# EAGLE design Stepper Motor Driver TIP Version v1.0 (EAGLE 6.5.0)
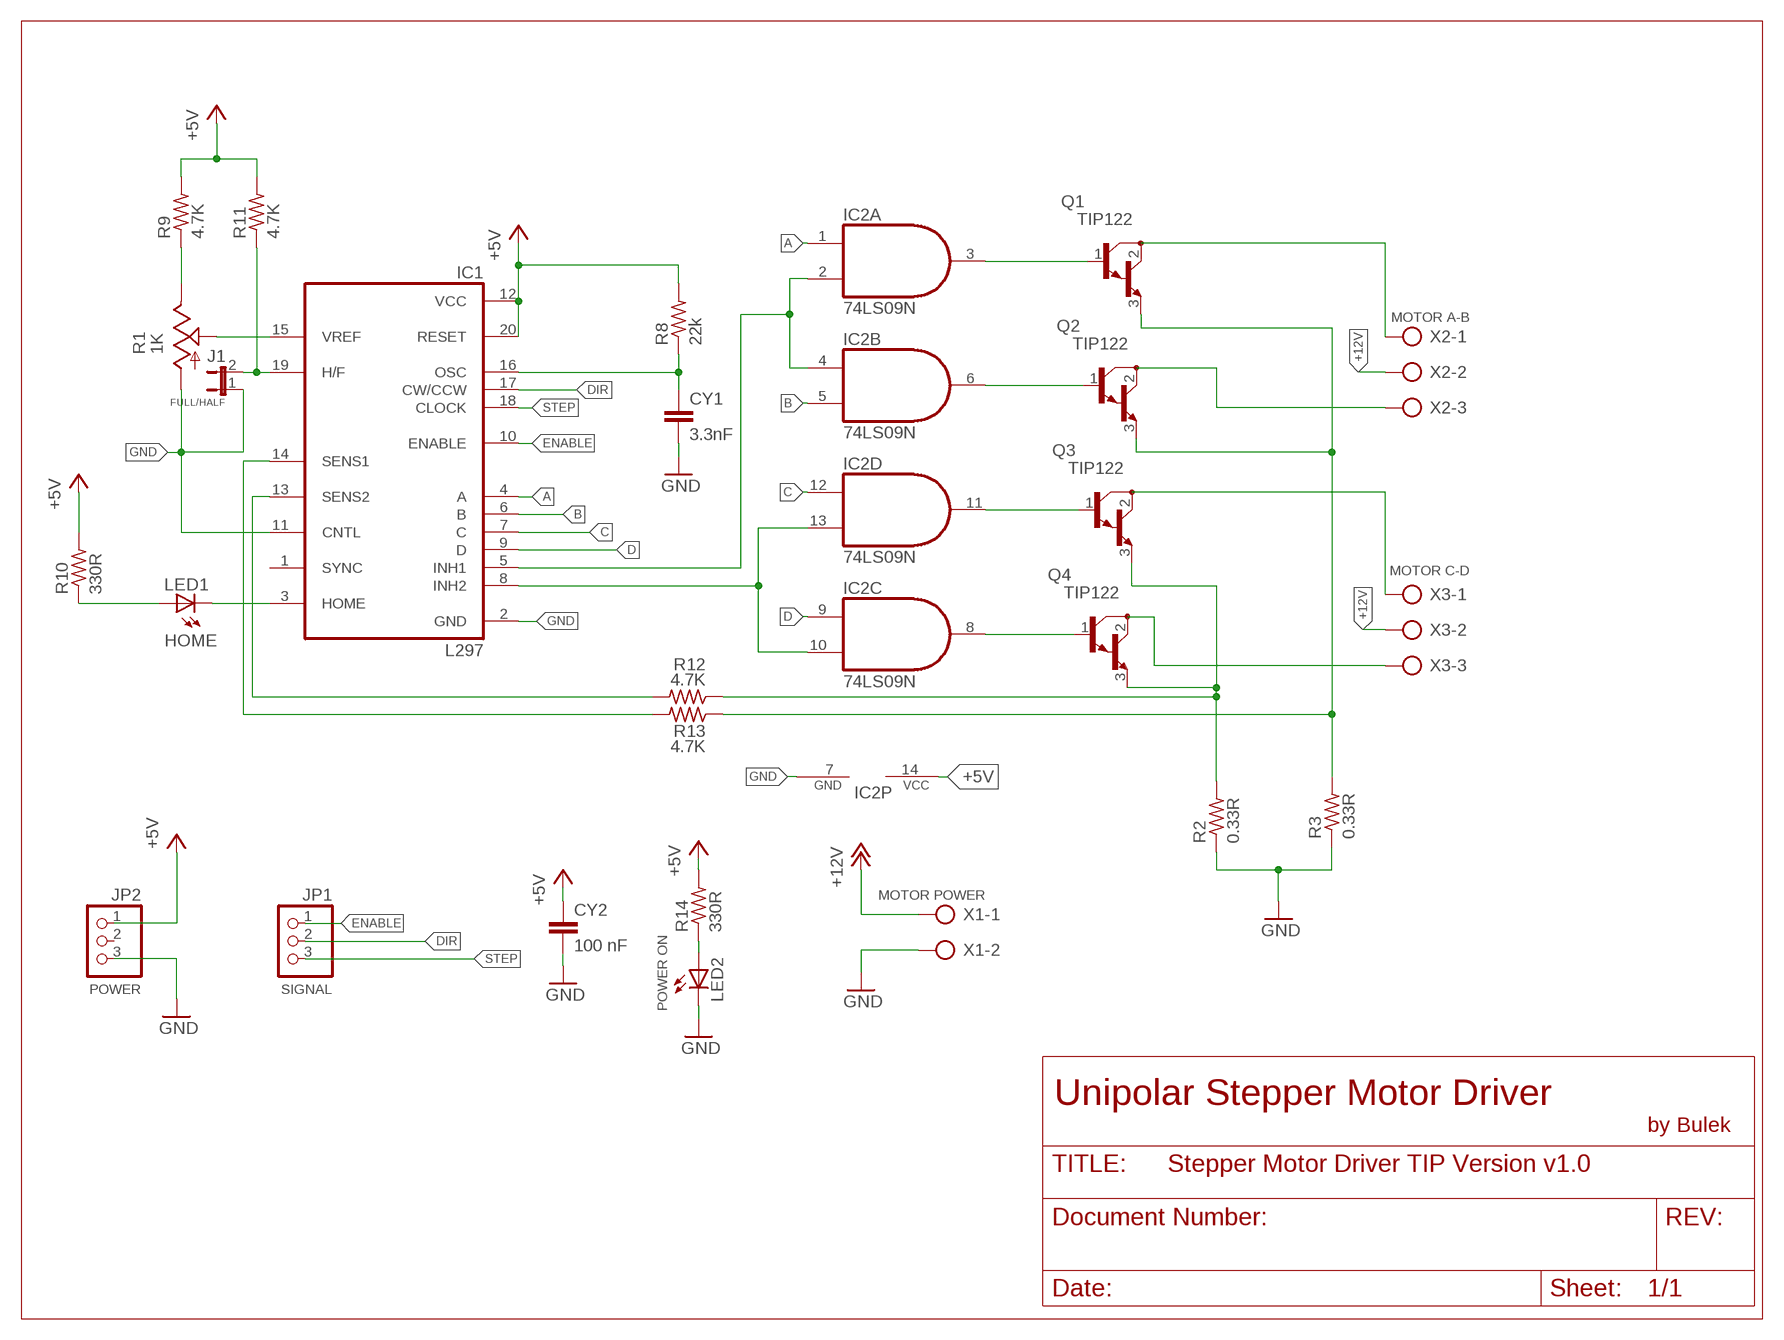
[diagram p0: schematic, sheet 1]

## Parts
CY1  3.3nF  CYYC7B5  [YC7B5]
CY2  100 nF  CYYC7B5  [YC7B5]
FULL/HALF  J1  JP1E  [JP1]
IC1  L297  [DIL20]
IC2  74LS09N  [DIL14]
JP1  SIGNAL  PINHD-1X3/90  [1X03/90]
JP2  POWER  PINHD-1X3/90  [1X03/90]
LED1  HOME  LED5MM  [LED5MM]
LED2  POWER ON  LED5MM  [LED5MM]
Q1  TIP122  [TO220V]
Q2  TIP122  [TO220V]
Q3  TIP122  [TO220V]
Q4  TIP122  [TO220V]
R1  1K  TRIM_US-S63X  [S63X]
R2  0.33R  R-US_0617/22  [0617/22]
R3  0.33R  R-US_0617/22  [0617/22]
R8  22k  R-US_0207/10  [0207/10]
R9  4.7K  R-US_0207/10  [0207/10]
R10  330R  R-US_0207/10  [0207/10]
R11  4.7K  R-US_0207/10  [0207/10]
R12  4.7K  R-US_0207/10  [0207/10]
R13  4.7K  R-US_0207/10  [0207/10]
R14  330R  R-US_0207/10  [0207/10]
X1  MOTOR POWER  AK300/2  [AK300/2]
X2  MOTOR A-B  AK300/3  [AK300/3]
X3  MOTOR C-D  AK300/3  [AK300/3]

## Nets
+5V: CY2.1 IC1.12(VCC) IC1.20(RESET) IC2.14(P:VCC) JP2.1 R8.2 R9.2 R10.2 R11.2 R14.2
+12V: X1.1 X2.2 X3.2
A: IC1.4(A) IC2.1(A:I0)
B: IC1.6(B) IC2.5(B:I1)
C: IC1.7(C) IC2.12(D:I0)
D: IC1.9(D) IC2.9(C:I0)
DIR: IC1.17(CW/CCW) JP1.2
ENABLE: IC1.10(ENABLE) JP1.1
GND: CY1.2 CY2.2 FULL/HALF.1 IC1.2(GND) IC1.11(CNTL) IC2.7(P:GND) JP2.3 LED2.K(C) R1.A R2.1 R3.1 X1.2
INH1: IC1.5(INH1) IC2.2(A:I1) IC2.4(B:I0)
INH2: IC1.8(INH2) IC2.10(C:I1) IC2.13(D:I1)
N$1: R1.E R9.1
N$2: IC1.15(VREF) R1.S
N$3: CY1.1 IC1.16(OSC) R8.1
N$4: IC1.3(HOME) LED1.K(C)
N$5: LED1.A R10.1
N$6: FULL/HALF.2 IC1.19(H/F) R11.1
N$7: IC1.14(SENS1) R13.2
N$8: IC1.13(SENS2) R12.2
N$9: IC2.8(C:O) Q4.1(B)
N$10: IC2.11(D:O) Q3.1(B)
N$11: IC2.6(B:O) Q2.1(B)
N$12: IC2.3(A:O) Q1.1(B)
N$13: Q1.3(E) Q2.3(E) R3.2 R13.1
N$14: Q3.3(E) Q4.3(E) R2.2 R12.1
N$15: Q1.2(C) X2.1
N$16: Q2.2(C) X2.3
N$17: Q3.2(C) X3.1
N$18: Q4.2(C) X3.3
N$20: LED2.A R14.1
STEP: IC1.18(CLOCK) JP1.3
Unconnected: IC1.1(SYNC) JP2.2

## Notes on the sheet
- Unipolar Stepper Motor Driver
- by Bulek

## Library data of the parts
CY1 CY2 = resistor:CY: Y CAPACITOR for power line
FULL/HALF = jumper:JP1E: JUMPER
IC1 = st-microelectronics:L297: STEPPER MOTOR CONTROLLER; MPN: L297/1; OC_FARNELL: 1094209; OC_NEWARK: 56P8258
IC2 = 74xx-us:74*09: Quad 2-input AND gate, open collector
JP1 JP2 = pinhead:PINHD-1X3: PIN HEADER
LED1 LED2 = led:LED: LED OSRAM: - CHIPLED LG R971, LG N971, LY N971, LG Q971, LY Q971, LO R971, LY R971 LH N974, LH R974 LS Q976, LO Q976, LY Q976 LO Q996 - Hyper CHIPLED LW Q18S LB Q993, LB Q99A, LB R99A - SideLED LS A670, LO A670, LY A670, LG A670, LP A670 LB A673, LV A673, LT A673, LW A673 LH A674 LY A675 LS A676, LA A676, LO A676, LY A676, LW A676 LS A679, LY A679, LG A679 - Hyper Micro SIDELED® LS Y876, LA Y876, LO Y876, LY Y876 LT Y87S - SmartLED LW L88C, LW L88S LB L89C, LB L89S, LG L890 LS L89K, LO L89K, LY L89K LS L896, LA L896, LO L896, LY L896 - TOPLED LS T670, LO T670, LY T670, LG T670, LP T670 LSG T670, LSP T670, LSY T670, LOP T670, LYG T670 LG T671, LOG T671, LSG T671 LB T673, LV T673, LT T673, LW T673 LH T674 LS T676, LA T676, LO T676, LY T676, LB T676, LH T676, LSB T676, LW T676 LB T67C, LV T67C, LT T67C, LS T67K, LO T67K, LY T67K, LW E67C LS E67B, LA E67B, LO E67B, LY E67B, LB E67C, LV E67C, LT E67C LW T67C LS T679, LY T679, LG T679 LS T770, LO T770, LY T770, LG T770, LP T770 LB T773, LV T773, LT T773, LW T773 LH T774 LS E675, LA E675, LY E675, LS T675 LS T776, LA T776, LO T776, LY T776, LB T776 LHGB T686 LT T68C, LB T68C - Hyper Mini TOPLED® LB M676 - Mini TOPLED Santana® LG M470 LS M47K, LO M47K, LY M47K Source: http://www.osram.convergy.de LUXEON: - LUMILED® LXK2-PW12-R00, LXK2-PW12-S00, LXK2-PW14-U00, LXK2-PW14-V00 LXK2-PM12-R00, LXK2-PM12-S00, LXK2-PM14-U00 LXK2-PE12-Q00, LXK2-PE12-R00, LXK2-PE12-S00, LXK2-PE14-T00, LXK2-PE14-U00 LXK2-PB12-K00, LXK2-PB12-L00, LXK2-PB12-M00, LXK2-PB14-N00, LXK2-PB14-P00, LXK2-PB14-Q00 LXK2-PR12-L00, LXK2-PR12-M00, LXK2-PR14-Q00, LXK2-PR14-R00 LXK2-PD12-Q00, LXK2-PD12-R00, LXK2-PD12-S00 LXK2-PH12-R00, LXK2-PH12-S00 LXK2-PL12-P00, LXK2-PL12-Q00, LXK2-PL12-R00 Source: www.luxeon.com KINGBRIGHT: KA-3528ASYC Source: www.kingbright.com
Q1-Q4 = transistor-npn:TIP122*: NPN Darlington Transistor
R1 = pot:TRIM_US-: POTENTIOMETER
R2 R3 R8-R14 = resistor:R-US_: RESISTOR, American symbol
X1 = con-ptr500:AK300/2: CONNECTOR; OC_FARNELL: unknown; OC_NEWARK: unknown
X2 X3 = con-ptr500:AK300/3: CONNECTOR; OC_FARNELL: unknown; OC_NEWARK: unknown

## Board
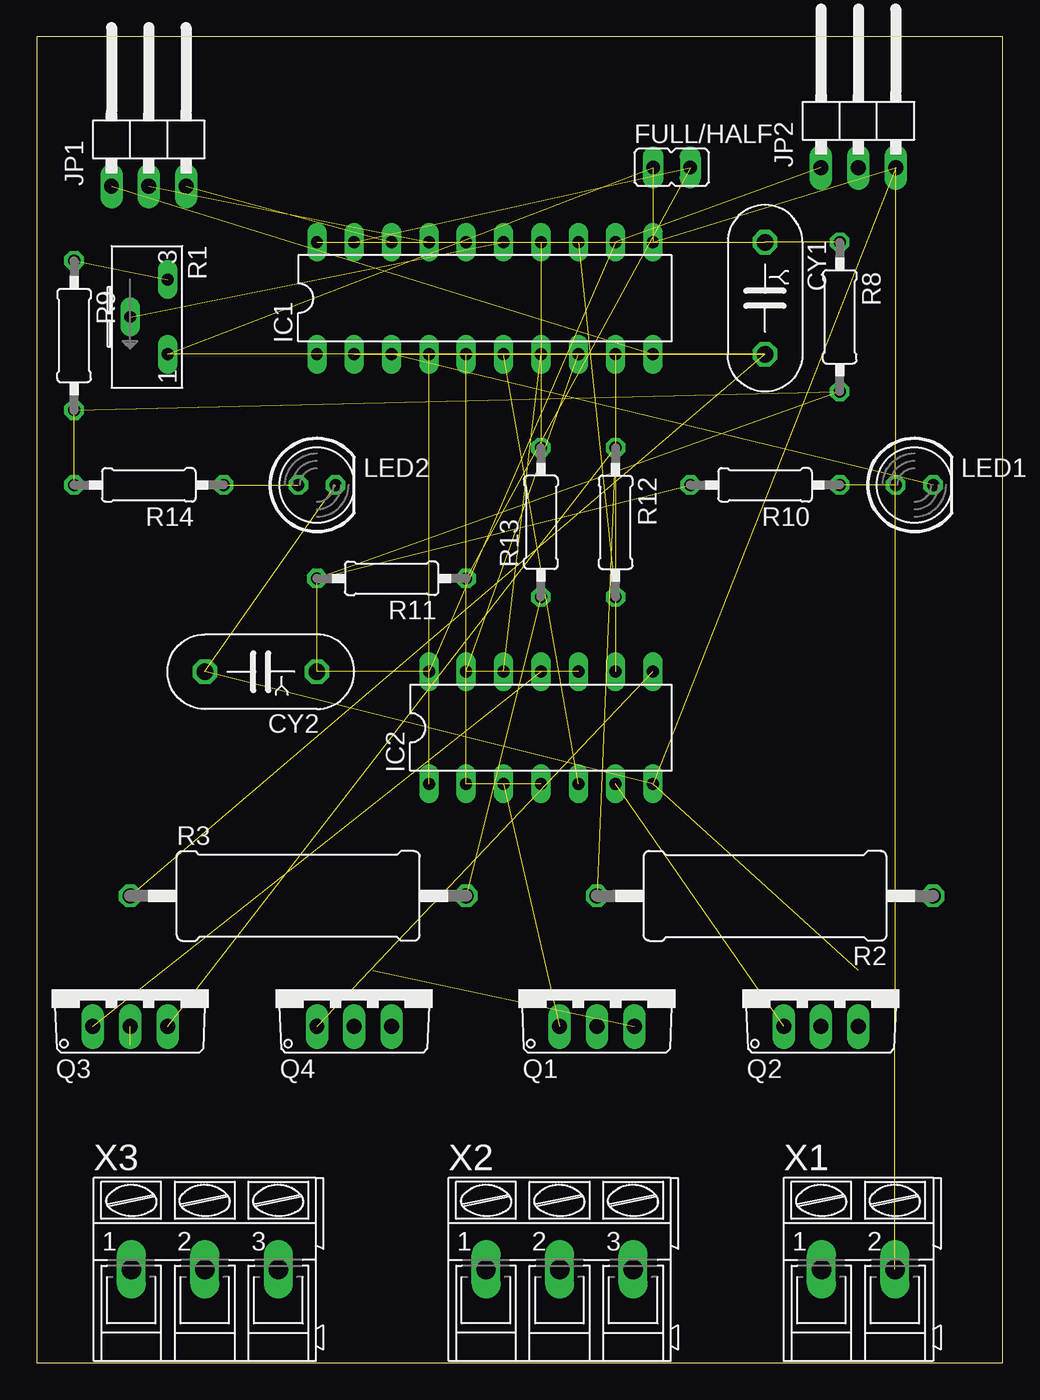
[diagram p1: board, top side]
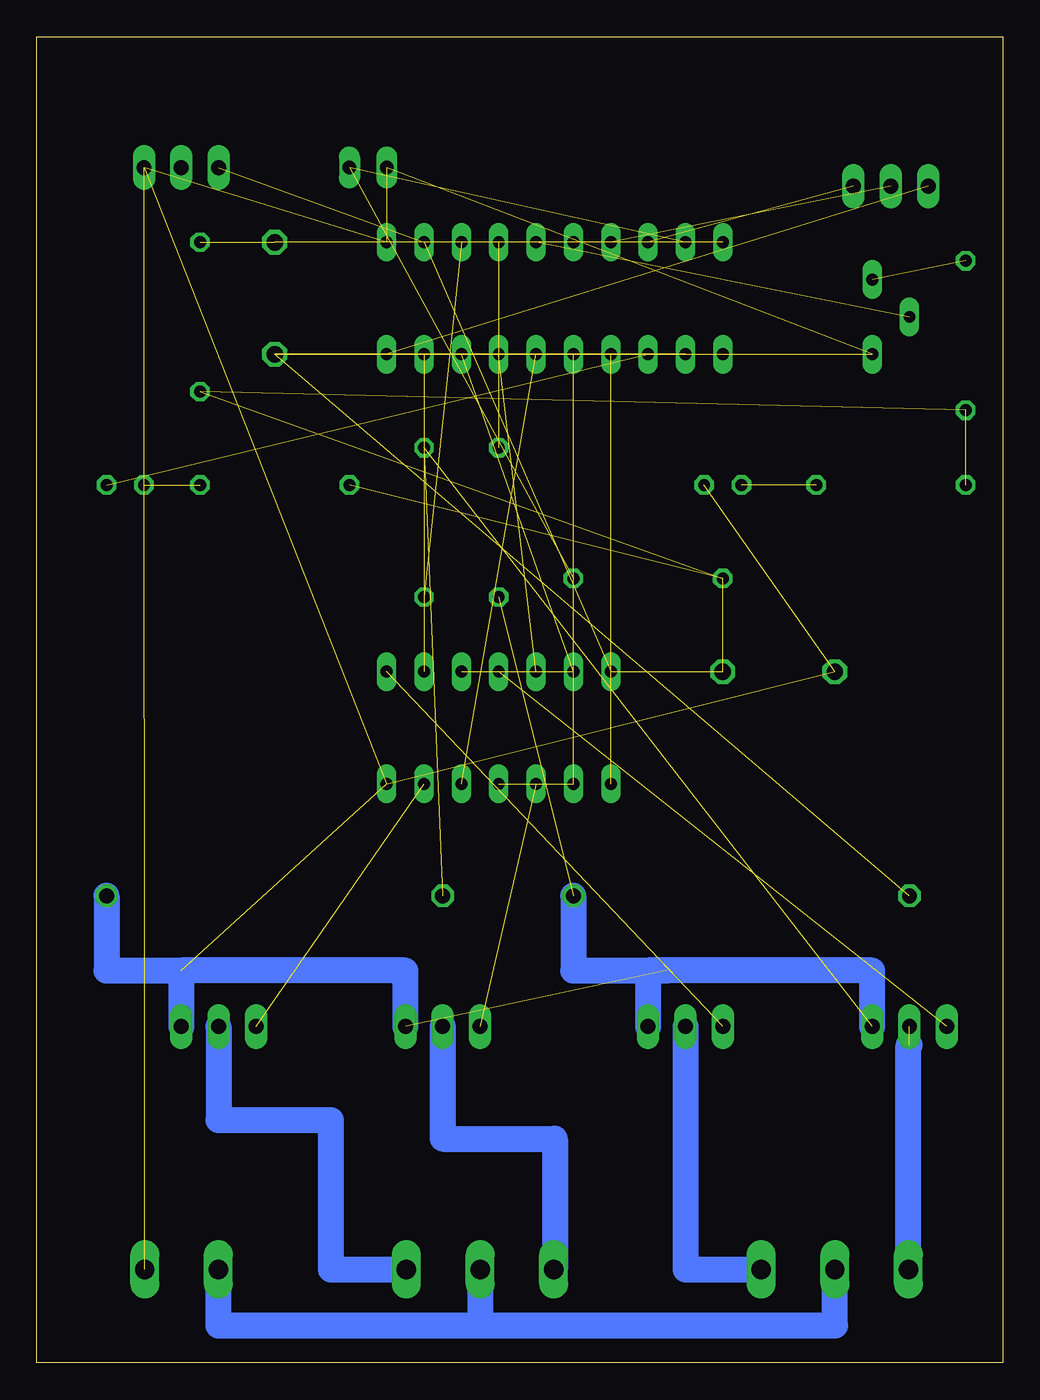
[diagram p2: board, bottom side, seen from below]

Size 65.71 x 90.17 mm. Coordinates in mm from the lower left corner, seen from the top.
Outline: 0,0 65.71,0 65.71,90.16 0,90.17 0,0
Copper layers (1*16): Top 0.035mm / dielectric 1.5mm / Bottom 0.035mm
Design rules "default": minimum track width 10mil, minimum drill 24mil, track to track 8mil, track to pad 8mil, pad to pad 8mil, via to via 8mil, smd to smd 8mil, copper to edge 40mil, drill to drill 8mil, minimum pad ring 10mil, minimum via ring 8mil, stop-mask expansion 4mil, vias tented up to drill 0mil, thermal gap 10mil

### Footprints (pad centres in the part's own frame; a part is rotated, then mirrored left to right if it is on the bottom)
YC7B5 = drill 1.118 octagon: 1 -3.81,0; 2 3.81,0
JP1 = drill 0.914 long: 1 0,-1.27; 2 0,1.27
DIL20 = drill 0.813 long: 1 -11.43,-3.81; 2 -8.89,-3.81; 3 -6.35,-3.81; 4 -3.81,-3.81; 5 -1.27,-3.81; 6 1.27,-3.81; 7 3.81,-3.81; 8 6.35,-3.81; 9 8.89,-3.81; 10 11.43,-3.81; 11 11.43,3.81; 12 8.89,3.81; 13 6.35,3.81; 14 3.81,3.81; 15 1.27,3.81; 16 -1.27,3.81; 17 -3.81,3.81; 18 -6.35,3.81; 19 -8.89,3.81; 20 -11.43,3.81
DIL14 = drill 0.813 long: 1 -7.62,-3.81; 2 -5.08,-3.81; 3 -2.54,-3.81; 4 0,-3.81; 5 2.54,-3.81; 6 5.08,-3.81; 7 7.62,-3.81; 8 7.62,3.81; 9 5.08,3.81; 10 2.54,3.81; 11 0,3.81; 12 -2.54,3.81; 13 -5.08,3.81; 14 -7.62,3.81
1X03/90 = drill 1.016 long: 1 -2.54,-3.81; 2 0,-3.81; 3 2.54,-3.81
LED5MM = drill 0.813 octagon: A -1.27,0; K 1.27,0
TO220V = drill 1.016 long: 1 -2.54,-2.54; 2 0,-2.54; 3 2.54,-2.54
S63X = drill 0.813 long: A 2.54,0; E -2.54,0; S 0,-2.54
0617/22 = drill 1.016 octagon: 1 -11.43,0; 2 11.43,0
0207/10 = drill 0.813 octagon: 1 -5.08,0; 2 5.08,0
AK300/2 = drill 1.321 long: 1 -2.515,0; 2 2.489,0
AK300/3 = drill 1.321 long: 1 -5.004,0; 2 0,0; 3 5.004,0

### Placement (x,y rotation side)
CY1  49.53,72.39 270 top
CY2  15.24,46.99 180 top
FULL/HALF  43.18,81.28 270 top
IC1  30.48,72.39 0 top
IC2  34.29,43.18 0 top
JP1  7.62,83.82 0 top
JP2  55.88,85.09 0 top
LED1  59.69,59.69 0 top
LED2  19.05,59.69 0 top
Q1  38.1,25.4 0 top
Q2  53.34,25.4 0 top
Q3  6.35,25.4 0 top
Q4  21.59,25.4 0 top
R1  8.89,71.12 270 top
R2  49.53,31.75 180 top
R3  17.78,31.75 0 top
R8  54.61,71.12 270 top
R9  2.54,69.85 270 top
R10  49.53,59.69 180 top
R11  24.13,53.34 180 top
R12  39.37,57.15 270 top
R13  34.29,57.15 90 top
R14  7.62,59.69 180 top
X1  55.88,6.35 0 top
X2  35.56,6.35 0 top
X3  11.43,6.35 0 top

### Tracks (layer width: path | path; a pad name or v marks a point on that pad's centre or on a via)
+5V  (9 unrouted)
+12V
  Bottom 1.778: X1.1 53.37,2.54 35.56,2.54 | X2.2 35.56,2.54 | 35.56,2.54 11.43,2.54 X3.2
A  (1 unrouted)
B  (1 unrouted)
C  (1 unrouted)
D  (1 unrouted)
DIR  (1 unrouted)
ENABLE  (1 unrouted)
GND  (11 unrouted)
  Bottom 1.778: R2.1 60.96,26.67 55.88,26.67
INH1  (2 unrouted)
INH2  (2 unrouted)
N$1  (1 unrouted)
N$2  (1 unrouted)
N$3  (2 unrouted)
N$4  (1 unrouted)
N$5  (1 unrouted)
N$6  (2 unrouted)
N$7  (1 unrouted)
N$8  (1 unrouted)
N$9  (1 unrouted)
N$10  (1 unrouted)
N$11  (1 unrouted)
N$12  (1 unrouted)
N$13  (2 unrouted)
  Bottom 1.778: R3.2 29.21,26.67 22.86,26.67 | Q1.3 40.64,26.67 55.88,26.67 Q2.3
N$14  (2 unrouted)
  Bottom 1.778: Q3.3 8.89,26.67 24.13,26.67 Q4.3
N$15
  Bottom 1.778: Q1.2 38.1,15.24 30.48,15.24 30.48,6.35 X2.1
N$16
  Bottom 1.778: Q2.2 53.34,16.51 45.72,16.51 45.72,6.35 X2.3
N$17  (1 unrouted)
  Bottom 1.778: X3.1 6.43,21.59 6.35,21.59
N$18
  Bottom 1.778: Q4.2 21.59,6.35 X3.3
N$20  (1 unrouted)
STEP  (1 unrouted)